# EAGLE design coin_cell_temp_sensor (EAGLE 7.3.0)
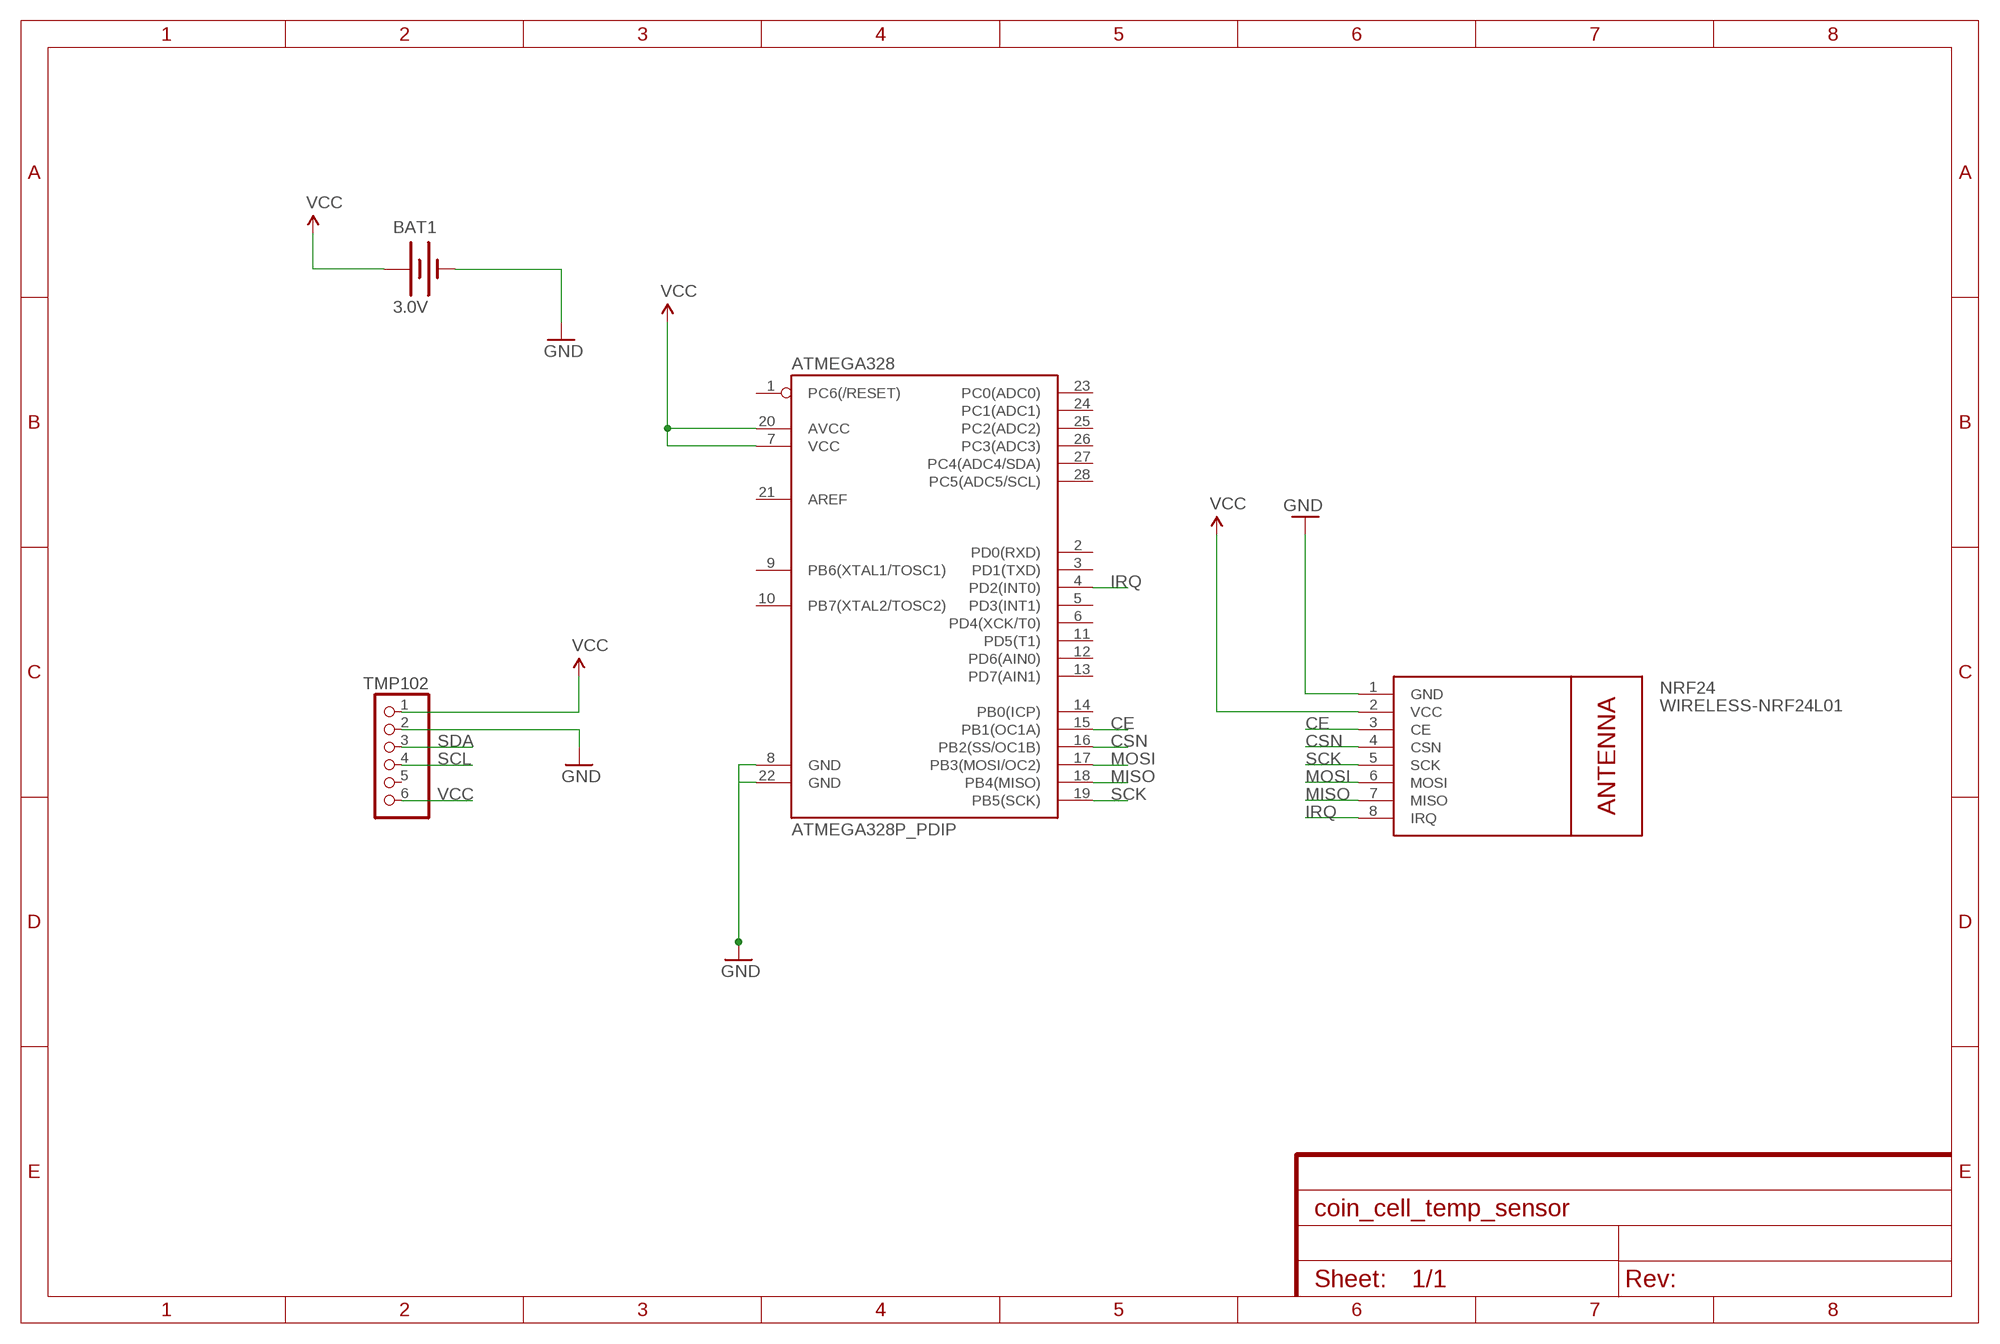
[diagram p0: schematic, sheet 1]
FRAME1 (FRAME-A4L): CNAME: Wireless Low Power Node; CREVISION: 1.0; DESIGNER: Valentin Mihov

## Parts
ATMEGA328  ATMEGA328P_PDIP  [DIL28-3]
BAT1  3.0V  BATTERY245PTH  [BATTCON_245MM_PTH]
NRF24  WIRELESS-NRF24L01  [WIRELESS-NRF24L01]
TMP102  PINHD-1X6  [1X06]

## Nets
CE [second layer]: ATMEGA328.15(PB1(OC1A)) NRF24.3(CE)
CSN [second layer]: ATMEGA328.16(PB2(SS/OC1B)) NRF24.4(CSN)
GND: ATMEGA328.8(GND) ATMEGA328.22(GND) BAT1.2(-) NRF24.1(GND) TMP102.2
IRQ [second layer]: ATMEGA328.4(PD2(INT0)) NRF24.8(IRQ)
MISO [second layer]: ATMEGA328.18(PB4(MISO)) NRF24.7(MISO)
MOSI [second layer]: ATMEGA328.17(PB3(MOSI/OC2)) NRF24.6(MOSI)
SCK [second layer]: ATMEGA328.19(PB5(SCK)) NRF24.5(SCK)
SCL [second layer]: TMP102.4
SDA [second layer]: TMP102.3
VCC: ATMEGA328.7(VCC) ATMEGA328.20(AVCC) BAT1.3(+) NRF24.2(VCC) TMP102.1 TMP102.6
Unconnected: ATMEGA328.1(PC6(/RESET)) ATMEGA328.2(PD0(RXD)) ATMEGA328.3(PD1(TXD)) ATMEGA328.5(PD3(INT1)) ATMEGA328.6(PD4(XCK/T0)) ATMEGA328.9(PB6(XTAL1/TOSC1)) ATMEGA328.10(PB7(XTAL2/TOSC2)) ATMEGA328.11(PD5(T1)) ATMEGA328.12(PD6(AIN0)) ATMEGA328.13(PD7(AIN1)) ATMEGA328.14(PB0(ICP)) ATMEGA328.21(AREF) ATMEGA328.23(PC0(ADC0)) ATMEGA328.24(PC1(ADC1)) ATMEGA328.25(PC2(ADC2)) ATMEGA328.26(PC3(ADC3)) ATMEGA328.27(PC4(ADC4/SDA)) ATMEGA328.28(PC5(ADC5/SCL)) TMP102.5

## Library data of the parts
ATMEGA328 = SparkFun-DigitalIC:ATMEGA328P_PDIP: uC used in the Arduino 32kb flash, 1k EEPROM, 2k SRAM This is the through-hole version of this chip.
BAT1 = SparkFun-Electromechanical:BATTERY: Battery Holders Various common sizes : AA, AAA, 18650 (PRT-12895), 20mm coin cell and 12mm coin cell. 20MM_4LEGS, BATT-10373
NRF24 = diy-modules:WIRELESS-NRF24L01: 2.4 GHz Wireless Module based on NRF24L01 chip
TMP102 = pinhead:PINHD-1X6: PIN HEADER

## Net classes
0 default: width 0.406 mm
1 second layer: width 0.61 mm

## Board
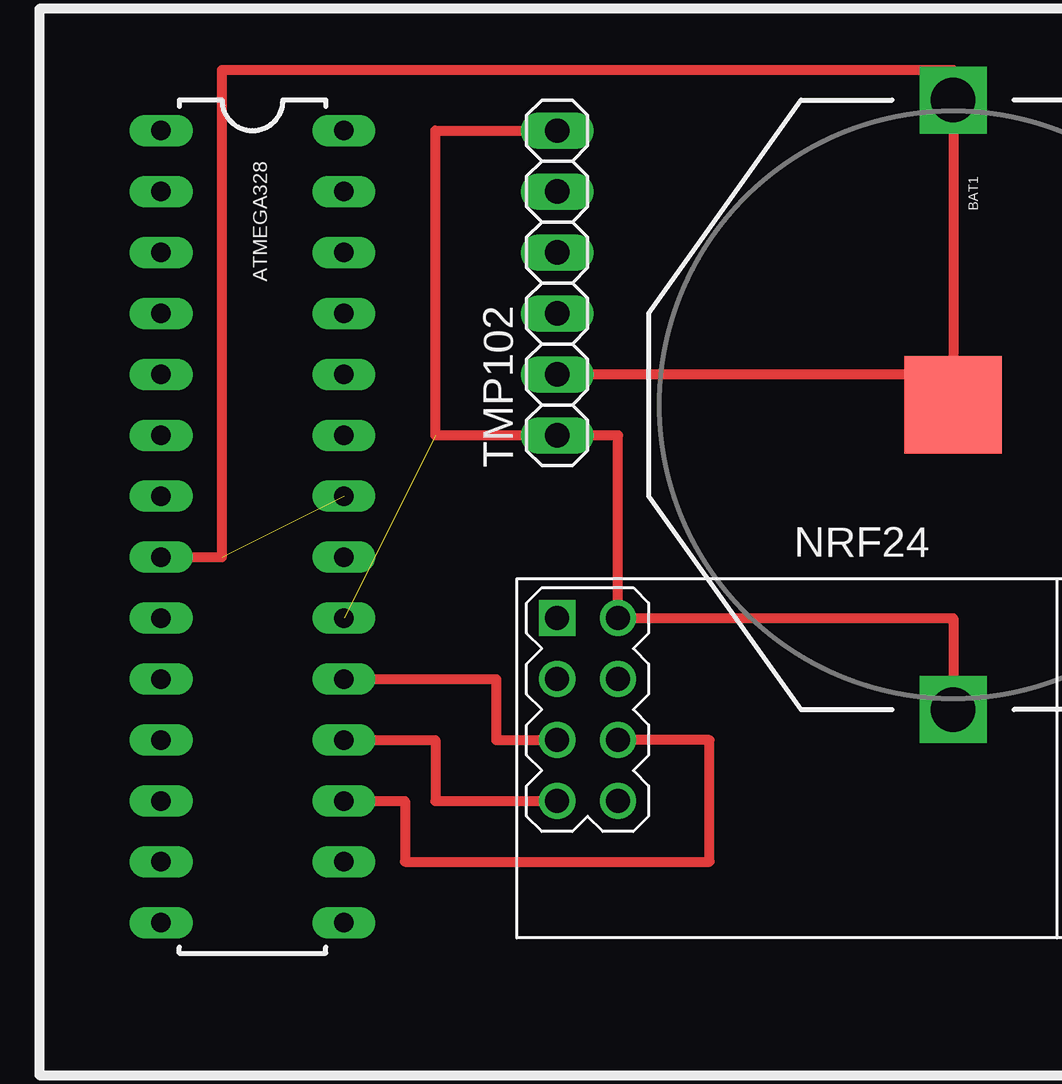
[diagram p1: board, top side]
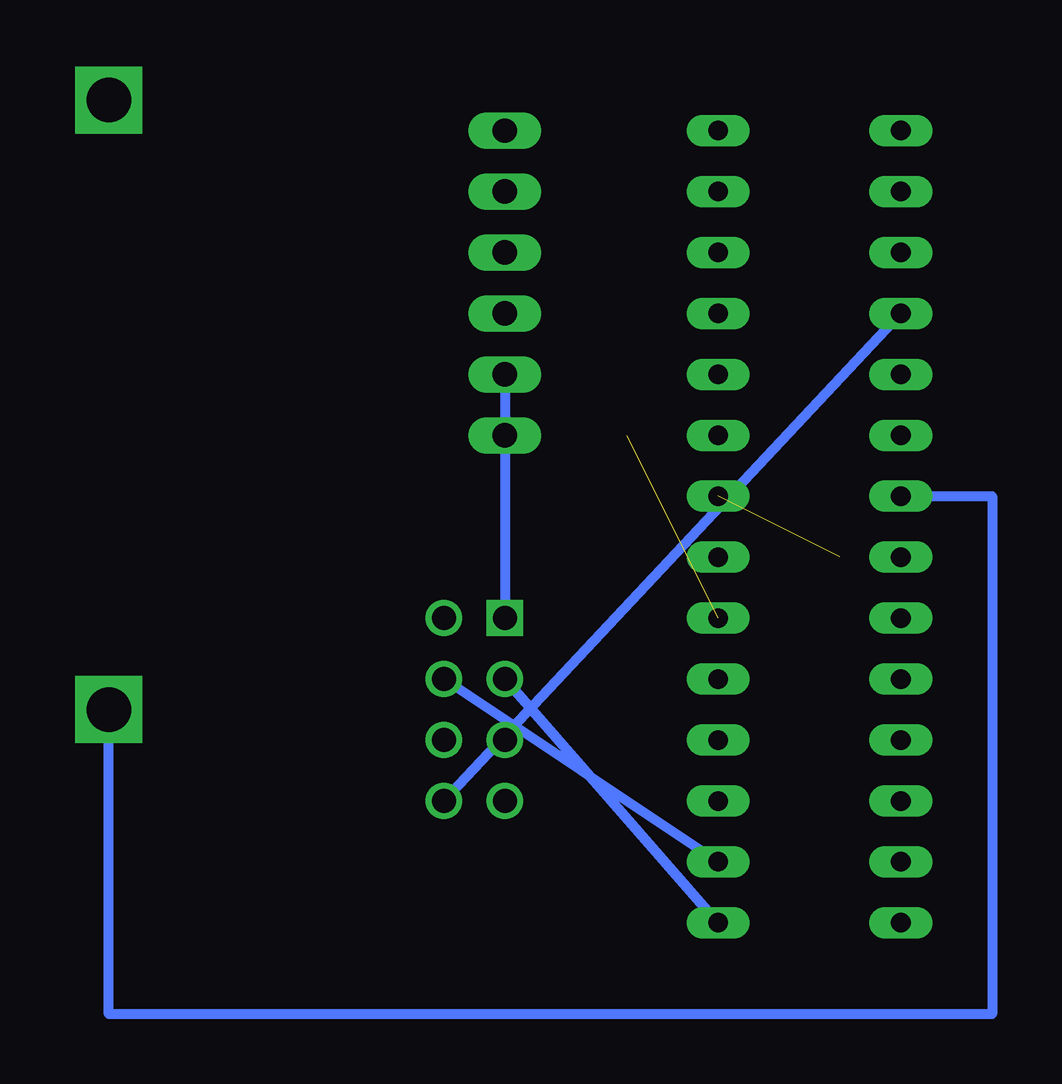
[diagram p2: board, bottom side, seen from below]

No outline drawn. Coordinates in mm, seen from the top.
Copper layers (1*16): Top 0.035mm / dielectric 1.5mm / Bottom 0.035mm
Design rules "default": minimum track width 10mil, minimum drill 24mil, track to track 8mil, track to pad 8mil, pad to pad 8mil, via to via 8mil, smd to smd 8mil, copper to edge 40mil, drill to drill 8mil, minimum pad ring 10mil, minimum via ring 8mil, stop-mask expansion 4mil, vias tented up to drill 0mil, thermal gap 10mil

### Footprints (pad centres in the part's own frame; a part is rotated, then mirrored left to right if it is on the bottom)
DIL28-3 = drill 0.813 long: 1 -16.51,-3.81; 2 -13.97,-3.81; 3 -11.43,-3.81; 4 -8.89,-3.81; 5 -6.35,-3.81; 6 -3.81,-3.81; 7 -1.27,-3.81; 8 1.27,-3.81; 9 3.81,-3.81; 10 6.35,-3.81; 11 8.89,-3.81; 12 11.43,-3.81; 13 13.97,-3.81; 14 16.51,-3.81; 15 16.51,3.81; 16 13.97,3.81; 17 11.43,3.81; 18 8.89,3.81; 19 6.35,3.81; 20 3.81,3.81; 21 1.27,3.81; 22 -1.27,3.81; 23 -3.81,3.81; 24 -6.35,3.81; 25 -8.89,3.81; 26 -11.43,3.81; 27 -13.97,3.81; 28 -16.51,3.81
BATTCON_245MM_PTH = drill 1.854 square: 1 -12.7,0; 3 12.7,0 | smd 4.064 x 4.064: 2 0,0
WIRELESS-NRF24L01 = drill 1 square: 1 -12.7,6.35 | drill 1: 2 -10.16,6.35; 3 -12.7,3.81; 4 -10.16,3.81; 5 -12.7,1.27; 6 -10.16,1.27; 7 -12.7,-1.27; 8 -10.16,-1.27
1X06 = drill 1.016 long: 1 -6.35,0; 2 -3.81,0; 3 -1.27,0; 4 1.27,0; 5 3.81,0; 6 6.35,0

### Placement (x,y rotation side)
ATMEGA328  13.97,57.15 270 top
BAT1  43.18,62.23 270 top
NRF24  39.37,46.99 0 top
TMP102  26.67,67.31 90 top

### Tracks (layer width: path | path; a pad name or v marks a point on that pad's centre or on a via)
CE
  Bottom 0.406: ATMEGA328.15 NRF24.3
CSN
  Bottom 0.406: ATMEGA328.16 NRF24.4
GND  (1 unrouted)
  Top 0.406: TMP102.2 43.18,63.5 BAT1.2 43.18,76.2 12.7,76.2 12.7,55.88 ATMEGA328.8
  Bottom 0.406: TMP102.2 NRF24.1
IRQ
  Bottom 0.406: ATMEGA328.4 NRF24.8
MISO
  Top 0.406: ATMEGA328.18 21.59,48.26 21.59,45.72 NRF24.7
MOSI
  Top 0.406: ATMEGA328.17 20.32,45.72 20.32,43.18 33.02,43.18 33.02,48.26 NRF24.6
SCK
  Top 0.406: ATMEGA328.19 24.13,50.8 24.13,48.26 NRF24.5
VCC  (1 unrouted)
  Top 0.406: BAT1.3 43.18,53.34 NRF24.2 29.21,60.96 TMP102.1 21.59,60.96 21.59,73.66 TMP102.6
  Bottom 0.406: ATMEGA328.7 6.35,58.42 6.35,36.83 43.18,36.83 BAT1.3